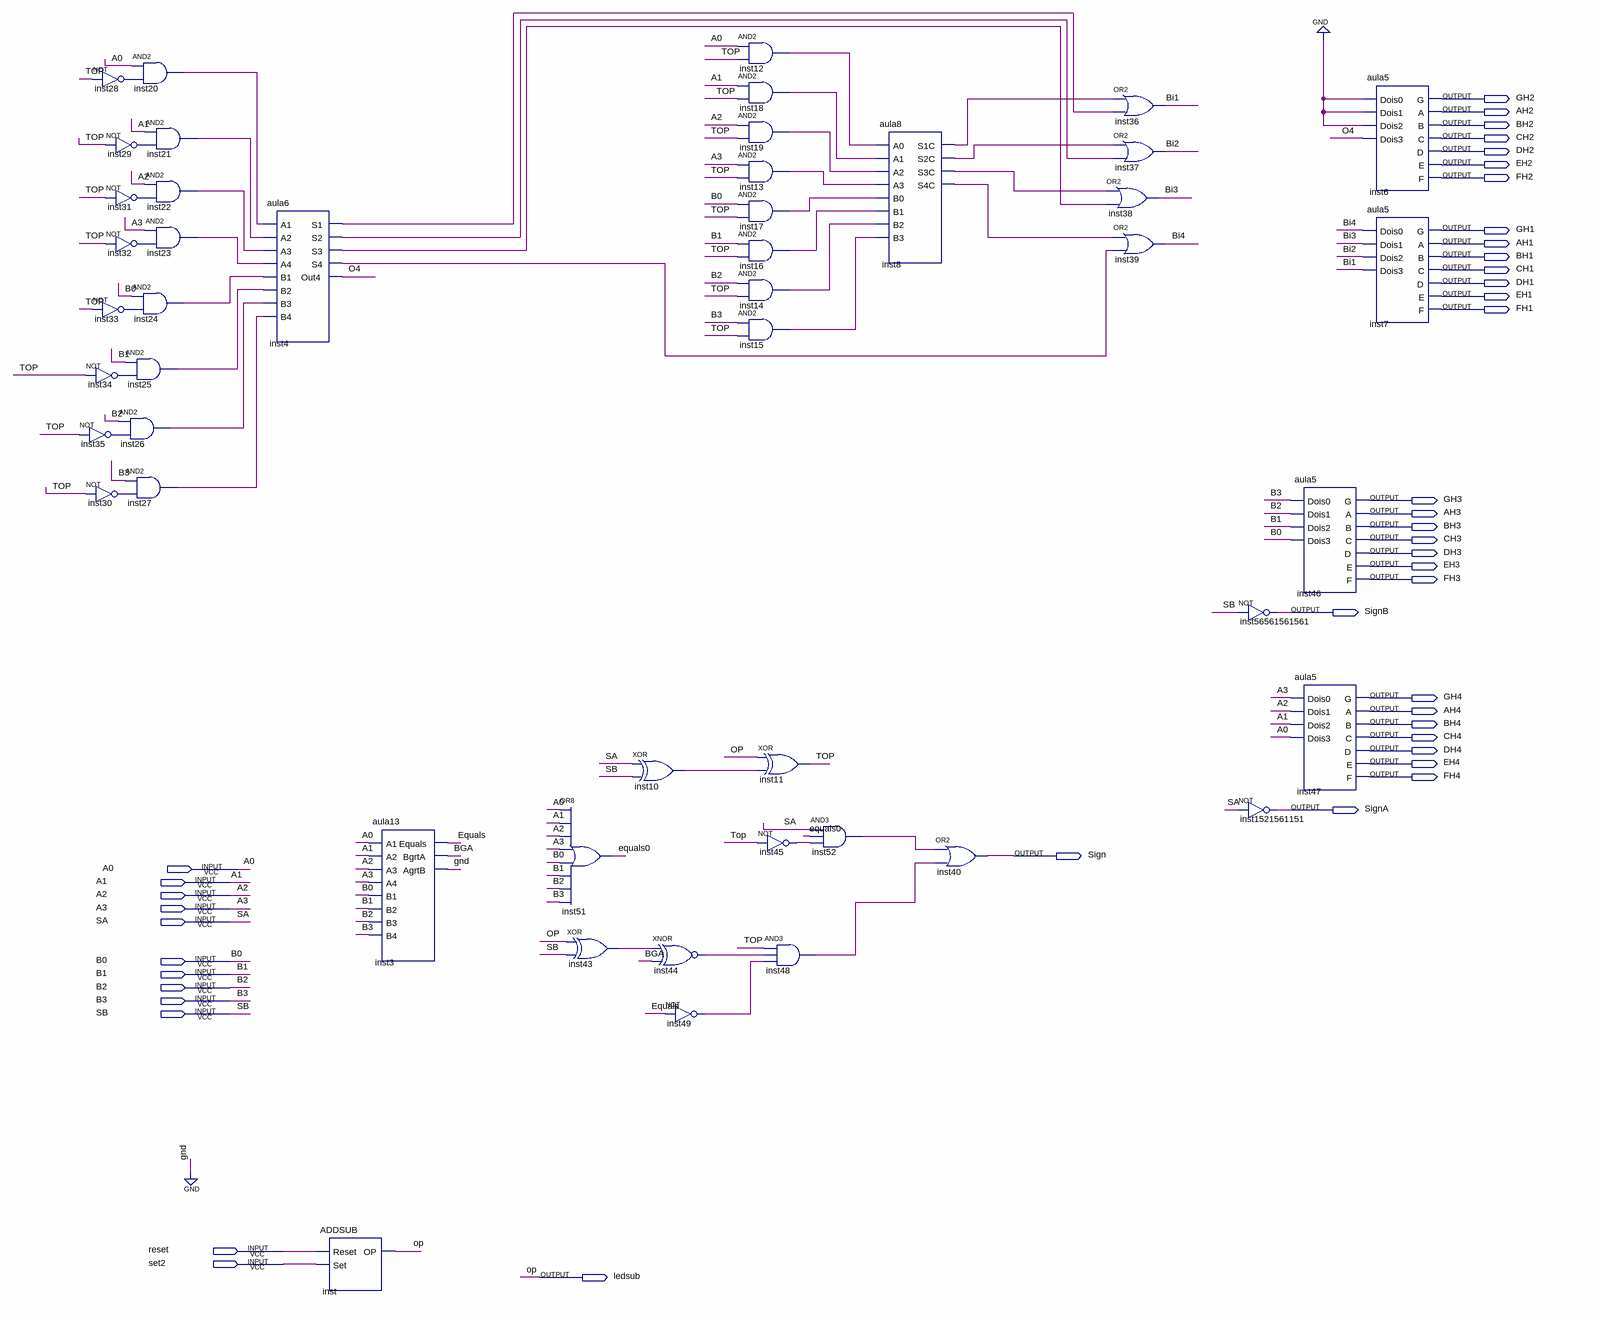
[diagram p0: schematic sheet]
// Quartus schematic aula9.bdf as structural Verilog: 48 symbols, 44 pins
module aula9 (
  input  A0,
  input  A1,
  input  A2,
  input  A3,
  input  SA,
  input  B0,
  input  B1,
  input  B2,
  input  B3,
  input  SB,
  input  reset,
  input  set2,
  output GH2,
  output AH2,
  output BH2,
  output CH2,
  output DH2,
  output EH2,
  output FH2,
  output GH1,
  output AH1,
  output BH1,
  output CH1,
  output DH1,
  output EH1,
  output FH1,
  output GH3,
  output AH3,
  output BH3,
  output CH3,
  output DH3,
  output EH3,
  output FH3,
  output SignB,
  output GH4,
  output AH4,
  output BH4,
  output CH4,
  output DH4,
  output EH4,
  output FH4,
  output SignA,
  output Sign,
  output ledsub
);

  wire BGA, Bi1, Bi2, Bi3, Bi4, Equals, equals0, gnd, inst4_s1, inst4_s2, inst4_s3, inst4_s4, inst8_s1c,
       inst8_s2c, inst8_s3c, inst8_s4c, inst10_out, inst12_out, inst13_out, inst14_out, inst15_out,
       inst16_out, inst17_out, inst18_out, inst19_out, inst20_out, inst21_out, inst22_out, inst23_out,
       inst24_out, inst25_out, inst26_out, inst27_out, inst28_out, inst29_out, inst30_out, inst31_out,
       inst32_out, inst33_out, inst34_out, inst35_out, inst43_out, inst44_out, inst45_out, inst48_out,
       inst49_out, inst52_out, O4, TOP;

  not inst28 (inst28_out, TOP);
  not inst33 (inst33_out, TOP);
  not inst34 (inst34_out, TOP);
  not inst35 (inst35_out, TOP);
  not inst30 (inst30_out, TOP);
  and inst20 (inst20_out, A0, inst28_out);
  and inst21 (inst21_out, A1, inst29_out);
  not inst29 (inst29_out, TOP);
  and inst22 (inst22_out, A2, inst31_out);
  not inst31 (inst31_out, TOP);
  and inst23 (inst23_out, A3, inst32_out);
  not inst32 (inst32_out, TOP);
  and inst24 (inst24_out, B0, inst33_out);
  and inst25 (inst25_out, B1, inst34_out);
  and inst26 (inst26_out, B2, inst35_out);
  and inst27 (inst27_out, B3, inst30_out);
  aula6 inst4 (
    .A1(inst20_out), .A2(inst21_out), .A3(inst22_out), .A4(inst23_out), .B1(inst24_out), .B2(inst25_out),
    .B3(inst26_out), .B4(inst27_out), .S1(inst4_s1), .S2(inst4_s2), .S3(inst4_s3), .S4(inst4_s4), .Out4(O4));
  ADDSUB inst (.Reset(reset), .Set(set2), .OP(ledsub));
  aula13 inst3 (
    .A1(A0), .A2(A1), .A3(A2), .A4(A3), .B1(B0), .B2(B1), .B3(B2), .B4(B3), .Equals(Equals), .BgrtA(BGA),
    .AgrtB(gnd));
  or inst51 (equals0, A0, A1, A2, A3, B0, B1, B2, B3);
  xor inst43 (inst43_out, ledsub, SB);
  xor inst10 (inst10_out, SA, SB);
  xnor inst44 (inst44_out, inst43_out, BGA);
  not inst49 (inst49_out, Equals);
  and inst12 (inst12_out, A0, TOP);
  and inst18 (inst18_out, A1, TOP);
  and inst19 (inst19_out, A2, TOP);
  and inst13 (inst13_out, A3, TOP);
  and inst17 (inst17_out, B0, TOP);
  and inst16 (inst16_out, B1, TOP);
  and inst14 (inst14_out, B2, TOP);
  and inst15 (inst15_out, B3, TOP);
  xor inst11 (TOP, ledsub, inst10_out);
  not inst45 (inst45_out, TOP);
  and inst48 (inst48_out, TOP, inst44_out, inst49_out);
  and inst52 (inst52_out, SA, equals0, inst45_out);
  aula8 inst8 (
    .A0(inst12_out), .A1(inst18_out), .A2(inst19_out), .A3(inst13_out), .B0(inst17_out), .B1(inst16_out),
    .B2(inst14_out), .B3(inst15_out), .S1C(inst8_s1c), .S2C(inst8_s2c), .S3C(inst8_s3c), .S4C(inst8_s4c));
  or inst40 (Sign, inst52_out, inst48_out);
  or inst36 (Bi1, inst8_s1c, inst4_s1);
  or inst37 (Bi2, inst8_s2c, inst4_s2);
  or inst38 (Bi3, inst8_s3c, inst4_s3);
  or inst39 (Bi4, inst8_s4c, inst4_s4);
  not inst56561561561 (SignB, SB);
  not inst1521561151 (SignA, SA);
  aula5 inst46 (
    .Dois0(B3), .Dois1(B2), .Dois2(B1), .Dois3(B0), .G(GH3), .A(AH3), .B(BH3), .C(CH3), .D(DH3), .E(EH3),
    .F(FH3));
  aula5 inst47 (
    .Dois0(A3), .Dois1(A2), .Dois2(A1), .Dois3(A0), .G(GH4), .A(AH4), .B(BH4), .C(CH4), .D(DH4), .E(EH4),
    .F(FH4));
  aula5 inst6 (
    .Dois0(1'b0), .Dois1(1'b0), .Dois2(1'b0), .Dois3(O4), .G(GH2), .A(AH2), .B(BH2), .C(CH2), .D(DH2),
    .E(EH2), .F(FH2));
  aula5 inst7 (
    .Dois0(Bi4), .Dois1(Bi3), .Dois2(Bi2), .Dois3(Bi1), .G(GH1), .A(AH1), .B(BH1), .C(CH1), .D(DH1), .E(EH1),
    .F(FH1));
  // also tied to GND on the sheet: gnd

  // Other names for the same wires on the sheet: OP = ledsub
endmodule
